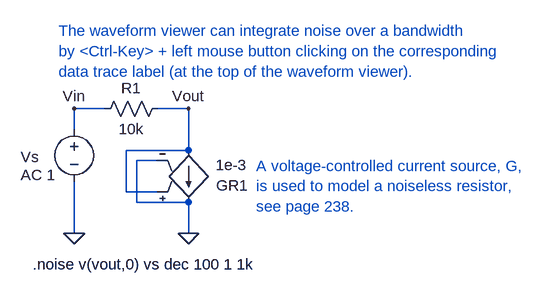
[diagram p0: schematic Ex8_10.asc]
Ex8_10.asc, the LTspice schematic file:
Version 4
SHEET 1 1072 704
WIRE 224 240 224 208
WIRE 224 400 224 320
WIRE 272 208 224 208
WIRE 304 336 304 272
WIRE 320 352 320 288
WIRE 352 288 320 288
WIRE 352 336 304 336
WIRE 400 208 352 208
WIRE 400 272 304 272
WIRE 400 272 400 208
WIRE 400 352 320 352
WIRE 400 400 400 352
FLAG 400 400 0
FLAG 224 400 0
FLAG 400 208 Vout
FLAG 224 208 Vin
SYMBOL res 256 224 R270
WINDOW 0 32 56 VTop 0
WINDOW 3 0 56 VBottom 0
SYMATTR InstName R1
SYMATTR Value 10k
SYMBOL voltage 224 224 R0
WINDOW 0 -82 58 Left 0
WINDOW 3 24 104 Invisible 0
WINDOW 123 -82 86 Left 0
WINDOW 39 0 0 Left 0
SYMATTR InstName Vs
SYMATTR Value 0
SYMATTR Value2 AC 1
SYMBOL g 400 368 M180
WINDOW 0 43 42 Left 0
WINDOW 3 42 73 Left 0
SYMATTR InstName GR1
SYMATTR Value 1e-3
TEXT 160 448 Left 0 !.noise v(vout,0) vs dec 100 1 1k
TEXT 200 88 Left 0 ;The waveform viewer can integrate noise over a bandwidth \nby <Ctrl-Key> + left mouse button clicking on the corresponding \ndata trace label (at the top of the waveform viewer).
TEXT 504 296 Left 0 ;A voltage-controlled current source, G,\nis used to model a noiseless resistor, \nsee page 238.

The netlist it stands for:
* Ex8_10.asc
R1 Vin Vout 10k
Vs Vin 0 0 AC 1
GR1 Vout 0 Vout 0 1e-3
.noise v(vout,0) vs dec 100 1 1k
* The waveform viewer can integrate noise over a bandwidth
* by <Ctrl-Key> + left mouse button clicking on the corresponding
* data trace label (at the top of the waveform viewer).
* A voltage-controlled current source, G,
* is used to model a noiseless resistor,
* see page 238.
.backanno
.end